# Altium schematic sheet PowerSheet1.SchDoc
size A3
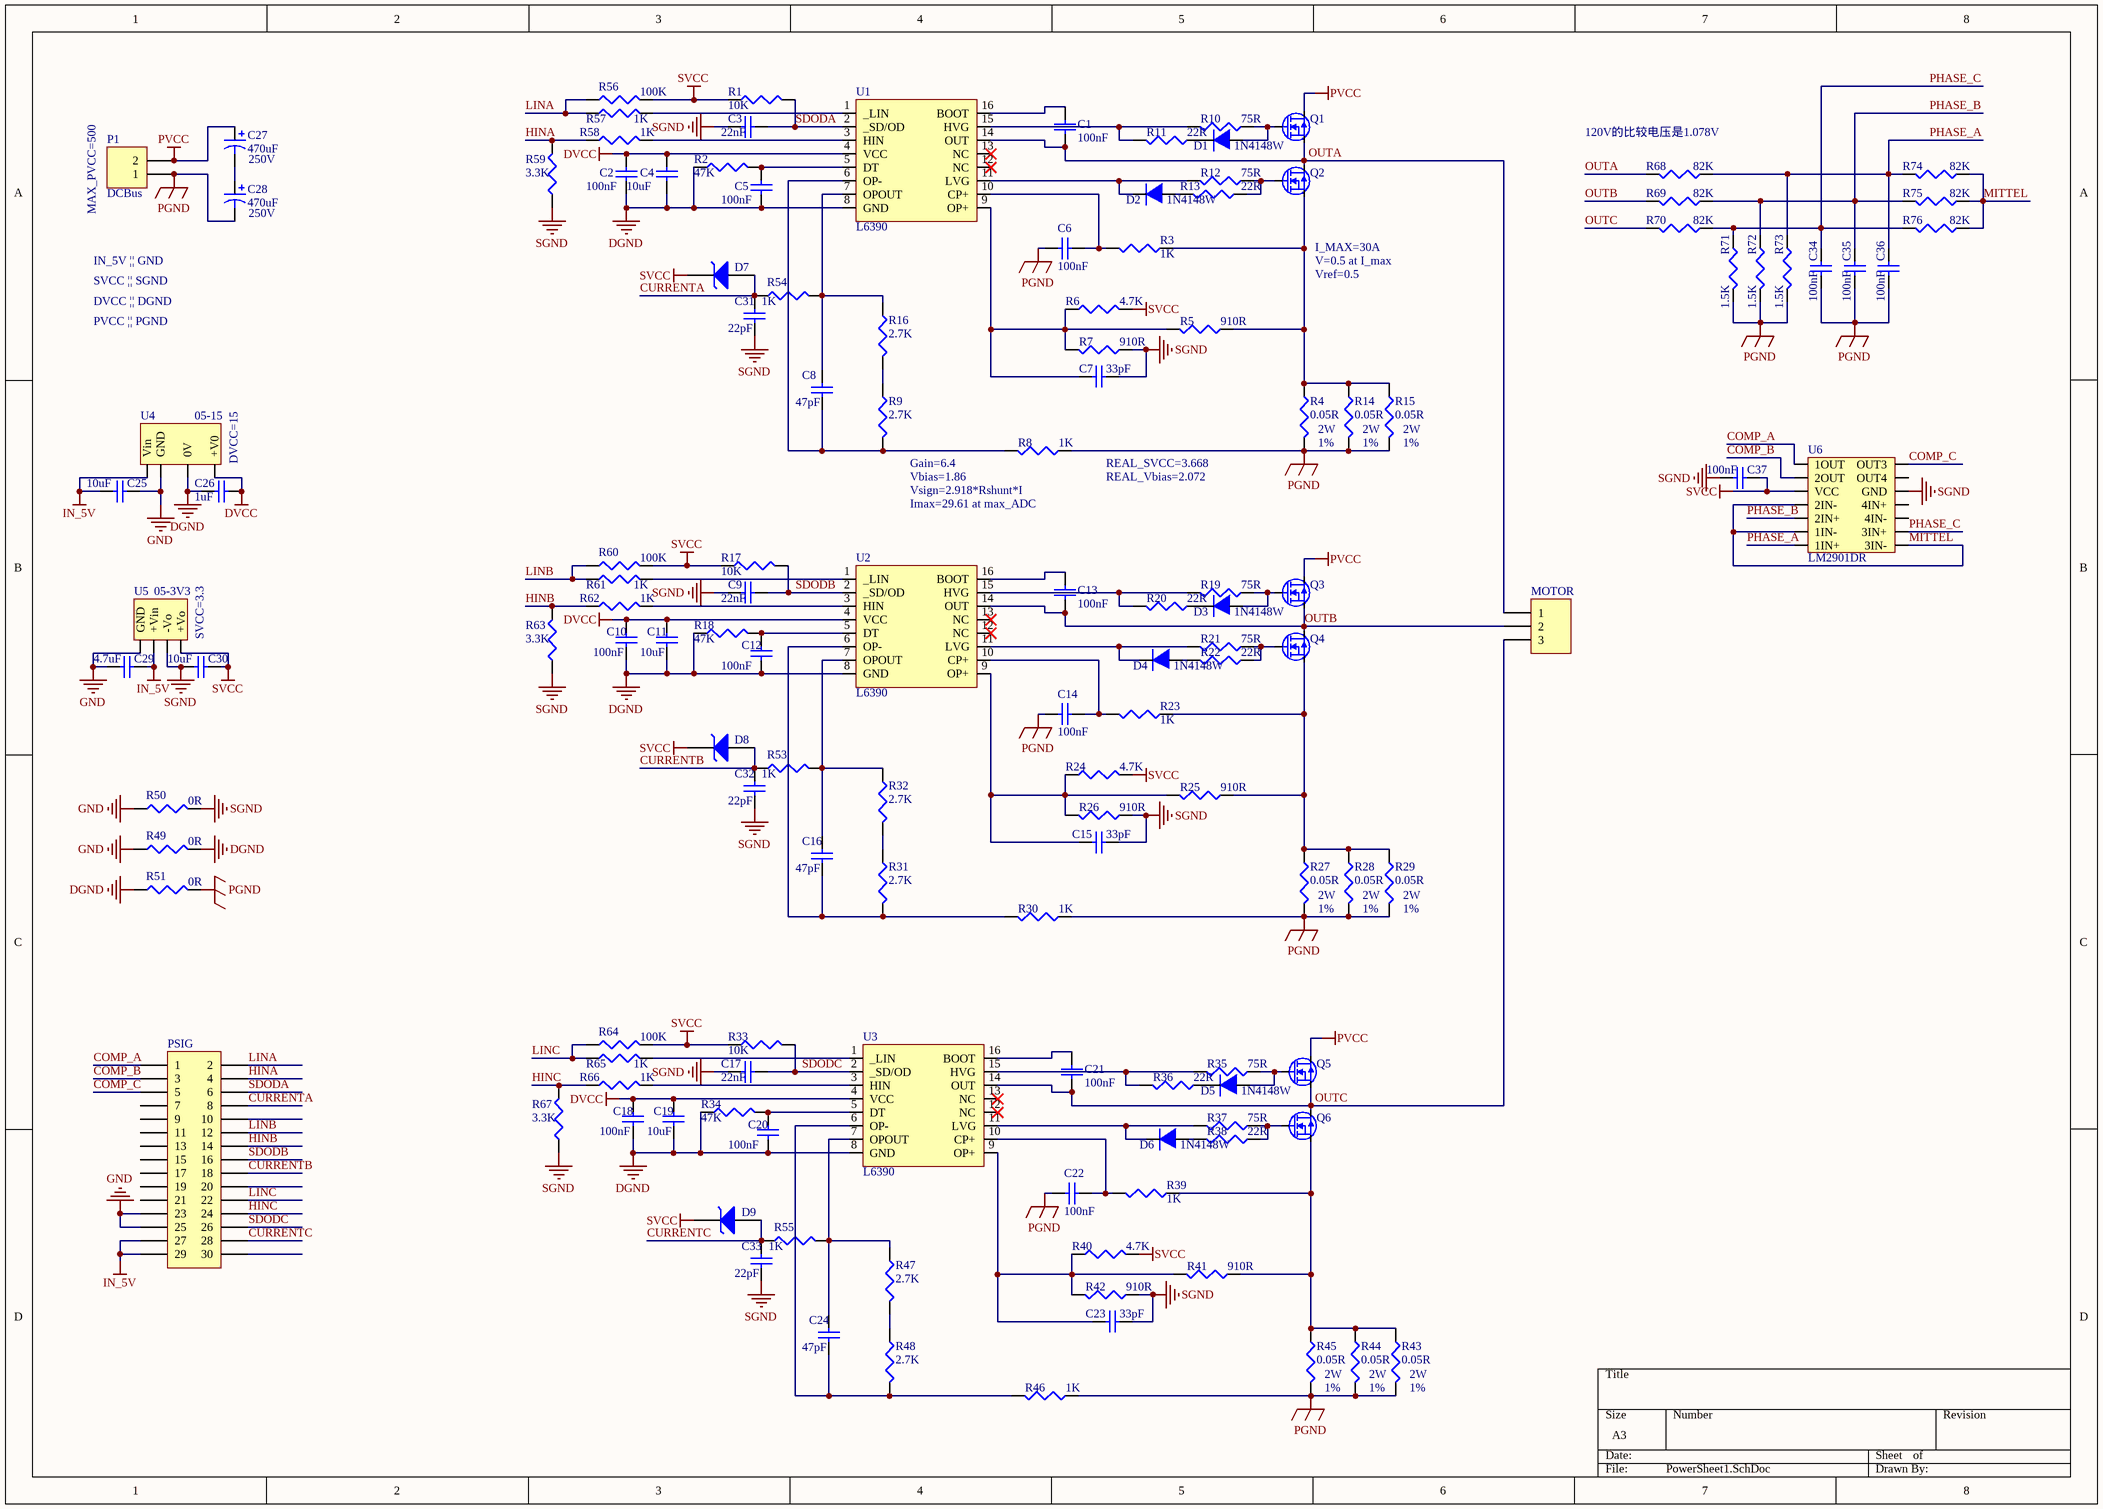
[diagram p0: PowerSheet1.SchDoc]

## Parts
C1  value 100nF  [LC-1210_C]  (hidden comment: Cap Semi)
C2  value 100nF  [LC-0805_C]  (hidden comment: Cap Semi)
C3  value 22nF  [LC-0805_C]  (hidden comment: Cap Semi)
C4  value 10uF  [LC-0805_C]  (hidden comment: Cap Semi)
C5  value 100nF  [LC-0805_C]  (hidden comment: Cap Semi)
C6  value 100nF  [LC-0805_C]  (hidden comment: Cap Semi)
C7  value 33pF  [LC-0805_C]  (hidden comment: Cap Semi)
C8  value 47pF  [LC-0805_C]  (hidden comment: Cap Semi)
C9  value 22nF  [LC-0805_C]  (hidden comment: Cap Semi)
C10  value 100nF  [LC-0805_C]  (hidden comment: Cap Semi)
C11  value 10uF  [LC-0805_C]  (hidden comment: Cap Semi)
C12  value 100nF  [LC-0805_C]  (hidden comment: Cap Semi)
C13  value 100nF  [LC-1210_C]  (hidden comment: Cap Semi)
C14  value 100nF  [LC-0805_C]  (hidden comment: Cap Semi)
C15  value 33pF  [LC-0805_C]  (hidden comment: Cap Semi)
C16  value 47pF  [LC-0805_C]  (hidden comment: Cap Semi)
C17  value 22nF  [LC-0805_C]  (hidden comment: Cap Semi)
C18  value 100nF  [LC-0805_C]  (hidden comment: Cap Semi)
C19  value 10uF  [LC-0805_C]  (hidden comment: Cap Semi)
C20  value 100nF  [LC-0805_C]  (hidden comment: Cap Semi)
C21  value 100nF  [LC-1210_C]  (hidden comment: Cap Semi)
C22  value 100nF  [LC-0805_C]  (hidden comment: Cap Semi)
C23  value 33pF  [LC-0805_C]  (hidden comment: Cap Semi)
C24  value 47pF  [LC-0805_C]  (hidden comment: Cap Semi)
C25  value 10uF  [LC-0805_C]  (hidden comment: Cap Semi)
C26  value 1uF  [LC-0805_C]  (hidden comment: Cap Semi)
C27  value 470uF  Voltage: 250V  [CAPACITORS]  (hidden comment: Cap Pol1)
C28  value 470uF  Voltage: 250V  [CAPACITORS]  (hidden comment: Cap Pol1)
C29  value 4.7uF  [LC-0805_C]  (hidden comment: Cap Semi)
C30  value 10uF  [LC-0805_C]  (hidden comment: Cap Semi)
C31  value 22pF  [LC-0805_C]  (hidden comment: Cap Semi)
C32  value 22pF  [LC-0805_C]  (hidden comment: Cap Semi)
C33  value 22pF  [LC-0805_C]  (hidden comment: Cap Semi)
C34  value 100nF  [LC-0805_C]  (hidden comment: Cap Semi)
C35  value 100nF  [LC-0805_C]  (hidden comment: Cap Semi)
C36  value 100nF  [LC-0805_C]  (hidden comment: Cap Semi)
C37  value 100nF  [LC-0805_C]  (hidden comment: Cap Semi)
D1  1N4148W  [SOD-123-D-IPC]
D2  1N4148W  [SOD-123-D-IPC]
D3  1N4148W  [SOD-123-D-IPC]
D4  1N4148W  [SOD-123-D-IPC]
D5  1N4148W  [SOD-123-D-IPC]
D6  1N4148W  [SOD-123-D-IPC]
D7  D Schottky  [MELF3416N]  (value not drawn)
D8  D Schottky  [MELF3416N]  (value not drawn)
D9  D Schottky  [MELF3416N]  (value not drawn)
MOTOR  Header 3  [MKDS5/3-9.5]  (value not drawn)
P1  DCBus  [MKDS5/2-9.5 - duplicate]
PSIG  Header 15X2  [HDR2X15]  (value not drawn)
Q1  MOSFET-N  [DPAK254P1525X450-3N-IPB60R080P7]  (value not drawn)
Q2  MOSFET-N  [DPAK254P1525X450-3N-IPB60R080P7]  (value not drawn)
Q3  MOSFET-N  [DPAK254P1525X450-3N-IPB60R080P7]  (value not drawn)
Q4  MOSFET-N  [DPAK254P1525X450-3N-IPB60R080P7]  (value not drawn)
Q5  MOSFET-N  [DPAK254P1525X450-3N-IPB60R080P7]  (value not drawn)
Q6  MOSFET-N  [DPAK254P1525X450-3N-IPB60R080P7]  (value not drawn)
R1  value 10K  [LC-0805_R]  (hidden comment: Res3)
R2  value 47K  [LC-0805_R]  (hidden comment: Res3)
R3  value 1K  [LC-0805_R]  (hidden comment: Res3)
R4  value 0.05R  Power: 2W  Precision: 1%  [12Z-2010]  (hidden comment: Res3)
R5  value 910R  [LC-0805_R]  (hidden comment: Res3)
R6  value 4.7K  [LC-0805_R]  (hidden comment: Res3)
R7  value 910R  [LC-0805_R]  (hidden comment: Res3)
R8  value 1K  [LC-0805_R]  (hidden comment: Res3)
R9  value 2.7K  [LC-0805_R]  (hidden comment: Res3)
R10  value 75R  [LC-0805_R]  (hidden comment: Res3)
R11  value 22R  [LC-0805_R]  (hidden comment: Res3)
R12  value 75R  [LC-0805_R]  (hidden comment: Res3)
R13  value 22R  [LC-0805_R]  (hidden comment: Res3)
R14  value 0.05R  Power: 2W  Precision: 1%  [12Z-2010]  (hidden comment: Res3)
R15  value 0.05R  Power: 2W  Precision: 1%  [12Z-2010]  (hidden comment: Res3)
R16  value 2.7K  [LC-0805_R]  (hidden comment: Res3)
R17  value 10K  [LC-0805_R]  (hidden comment: Res3)
R18  value 47K  [LC-0805_R]  (hidden comment: Res3)
R19  value 75R  [LC-0805_R]  (hidden comment: Res3)
R20  value 22R  [LC-0805_R]  (hidden comment: Res3)
R21  value 75R  [LC-0805_R]  (hidden comment: Res3)
R22  value 22R  [LC-0805_R]  (hidden comment: Res3)
R23  value 1K  [LC-0805_R]  (hidden comment: Res3)
R24  value 4.7K  [LC-0805_R]  (hidden comment: Res3)
R25  value 910R  [LC-0805_R]  (hidden comment: Res3)
R26  value 910R  [LC-0805_R]  (hidden comment: Res3)
R27  value 0.05R  Power: 2W  Precision: 1%  [12Z-2010]  (hidden comment: Res3)
R28  value 0.05R  Power: 2W  Precision: 1%  [12Z-2010]  (hidden comment: Res3)
R29  value 0.05R  Power: 2W  Precision: 1%  [12Z-2010]  (hidden comment: Res3)
R30  value 1K  [LC-0805_R]  (hidden comment: Res3)
R31  value 2.7K  [LC-0805_R]  (hidden comment: Res3)
R32  value 2.7K  [LC-0805_R]  (hidden comment: Res3)
R33  value 10K  [LC-0805_R]  (hidden comment: Res3)
R34  value 47K  [LC-0805_R]  (hidden comment: Res3)
R35  value 75R  [LC-0805_R]  (hidden comment: Res3)
R36  value 22R  [LC-0805_R]  (hidden comment: Res3)
R37  value 75R  [LC-0805_R]  (hidden comment: Res3)
R38  value 22R  [LC-0805_R]  (hidden comment: Res3)
R39  value 1K  [LC-0805_R]  (hidden comment: Res3)
R40  value 4.7K  [LC-0805_R]  (hidden comment: Res3)
R41  value 910R  [LC-0805_R]  (hidden comment: Res3)
R42  value 910R  [LC-0805_R]  (hidden comment: Res3)
R43  value 0.05R  Power: 2W  Precision: 1%  [12Z-2010]  (hidden comment: Res3)
R44  value 0.05R  Power: 2W  Precision: 1%  [12Z-2010]  (hidden comment: Res3)
R45  value 0.05R  Power: 2W  Precision: 1%  [12Z-2010]  (hidden comment: Res3)
R46  value 1K  [LC-0805_R]  (hidden comment: Res3)
R47  value 2.7K  [LC-0805_R]  (hidden comment: Res3)
R48  value 2.7K  [LC-0805_R]  (hidden comment: Res3)
R49  value 0R  [LC-0805_R]  (hidden comment: Res3)
R50  value 0R  [LC-0805_R]  (hidden comment: Res3)
R51  value 0R  [LC-0805_R]  (hidden comment: Res3)
R53  value 1K  [LC-0805_R]  (hidden comment: Res3)
R54  value 1K  [LC-0805_R]  (hidden comment: Res3)
R55  value 1K  [LC-0805_R]  (hidden comment: Res3)
R56  value 100K  [LC-0805_R]  (hidden comment: Res3)
R57  value 1K  [LC-0805_R]  (hidden comment: Res3)
R58  value 1K  [LC-0805_R]  (hidden comment: Res3)
R59  value 3.3K  [LC-0805_R]  (hidden comment: Res3)
R60  value 100K  [LC-0805_R]  (hidden comment: Res3)
R61  value 1K  [LC-0805_R]  (hidden comment: Res3)
R62  value 1K  [LC-0805_R]  (hidden comment: Res3)
R63  value 3.3K  [LC-0805_R]  (hidden comment: Res3)
R64  value 100K  [LC-0805_R]  (hidden comment: Res3)
R65  value 1K  [LC-0805_R]  (hidden comment: Res3)
R66  value 1K  [LC-0805_R]  (hidden comment: Res3)
R67  value 3.3K  [LC-0805_R]  (hidden comment: Res3)
R68  value 82K  [LC-0805_R]  (hidden comment: Res3)
R69  value 82K  [LC-0805_R]  (hidden comment: Res3)
R70  value 82K  [LC-0805_R]  (hidden comment: Res3)
R71  value 1.5K  [LC-0805_R]  (hidden comment: Res3)
R72  value 1.5K  [LC-0805_R]  (hidden comment: Res3)
R73  value 1.5K  [LC-0805_R]  (hidden comment: Res3)
R74  value 82K  [LC-0805_R]  (hidden comment: Res3)
R75  value 82K  [LC-0805_R]  (hidden comment: Res3)
R76  value 82K  [LC-0805_R]  (hidden comment: Res3)
U1  L6390  [SOIC127P660X175-16N]
U2  L6390  [SOIC127P660X175-16N]
U3  L6390  [SOIC127P660X175-16N]
U4  05-15  [ZY0515IB/FS-1W]
U5  05-3V3  [NN1-05S3V3A]
U6  LM2901DR  [LC-SOIC-14_150mil]

## Nets
DGND: C2.1 C4.1 C5.1 C10.1 C11.1 C12.1 C18.1 C19.1 C20.1 C26.2 R2.1 R18.1 R34.1 R49.2 R51.1 U1.8(GND) U2.8(GND) U3.8(GND) U4.4(0V)
DVCC: C2.2 C4.2 C10.2 C11.2 C18.2 C19.2 C26.1 U1.4(VCC) U2.4(VCC) U3.4(VCC) U4.6(+V0)
GND: C25.1 C29.2 PSIG.23 PSIG.25 R49.1 R50.1 U4.2(GND) U5.1(GND)
IN_5V: C25.2 C29.1 PSIG.27 PSIG.29 U4.1(Vin) U5.2(+Vin)
PGND: C6.2 C14.2 C22.2 C28.2 C34.2 C35.2 C36.2 P1.1 R4.2 R8.1 R14.2 R15.2 R27.2 R28.2 R29.2 R30.1 R43.2 R44.2 R45.2 R46.1 R51.2 R71.2 R72.2 R73.2
PVCC: C27.1 P1.2 Q1.D Q3.D Q5.D
SGND: C3.2 C7.2 C9.2 C15.2 C17.2 C23.2 C30.2 C31.2 C32.2 C33.2 C37.1 R7.1 R26.1 R42.1 R50.2 R59.1 R63.1 R67.1 U5.3(-Vo) U6.12(GND)
SVCC: C30.1 C37.2 D7.2(K) D8.2(K) D9.2(K) R1.1 R6.2 R17.1 R24.2 R33.1 R40.2 R56.2 R60.2 R64.2 U5.4(+Vo) U6.3(VCC)
COMP_A: PSIG.1 U6.1(1OUT)
COMP_B: PSIG.3 U6.2(2OUT)
COMP_C: PSIG.5 U6.14(OUT3)
CURRENTA: C31.1 D7.1(A) PSIG.8 R54.1
CURRENTB: C32.1 D8.1(A) PSIG.18 R53.1
CURRENTC: C33.1 D9.1(A) PSIG.28 R55.1
HINA: PSIG.4 R58.1 R59.2
HINB: PSIG.14 R62.1 R63.2
HINC: PSIG.24 R66.1 R67.2
LINA: PSIG.2 R56.1 R57.1
LINB: PSIG.12 R60.1 R61.1
LINC: PSIG.22 R64.1 R65.1
MITTEL: R74.1 R75.1 R76.1 U6.4(2IN-) U6.6(1IN-) U6.8(3IN-)
OUTA: C1.1 MOTOR.1 Q1.S Q2.D R68.2 U1.14(OUT)
OUTB: C13.1 MOTOR.2 Q3.S Q4.D R69.2 U2.14(OUT)
OUTC: C21.1 MOTOR.3 Q5.S Q6.D R70.2 U3.14(OUT)
PHASE_A: C36.1 R68.1 R73.1 R74.2 U6.7(1IN+)
PHASE_B: C35.1 R69.1 R72.1 R75.2 U6.5(2IN+)
PHASE_C: C34.1 R70.1 R71.1 R76.2 U6.9(3IN+)
SDODA: C3.1 PSIG.6 R1.2 U1.2(_SD/OD)
SDODB: C9.1 PSIG.16 R17.2 U2.2(_SD/OD)
SDODC: C17.1 PSIG.26 R33.2 U3.2(_SD/OD)
NetC1_2: C1.2 U1.16(BOOT)
NetC5_2: C5.2 R2.2 U1.5(DT)
NetC6_1: C6.1 R3.2 U1.10(CP+)
NetC7_1: C7.1 R5.2 R6.1 R7.2 U1.9(OP+)
NetC8_1: C8.1 R16.1 R54.2 U1.7(OPOUT)
NetC8_2: C8.2 R8.2 R9.2 U1.6(OP-)
NetC12_2: C12.2 R18.2 U2.5(DT)
NetC13_2: C13.2 U2.16(BOOT)
NetC14_1: C14.1 R23.2 U2.10(CP+)
NetC15_1: C15.1 R24.1 R25.2 R26.2 U2.9(OP+)
NetC16_1: C16.1 R32.1 R53.2 U2.7(OPOUT)
NetC16_2: C16.2 R30.2 R31.2 U2.6(OP-)
NetC20_2: C20.2 R34.2 U3.5(DT)
NetC21_2: C21.2 U3.16(BOOT)
NetC22_1: C22.1 R39.2 U3.10(CP+)
NetC23_1: C23.1 R40.1 R41.2 R42.2 U3.9(OP+)
NetC24_1: C24.1 R47.1 R55.2 U3.7(OPOUT)
NetC24_2: C24.2 R46.2 R48.2 U3.6(OP-)
NetC27_2: C27.2 C28.1
NetD1_1: D1.1 R11.1
NetD1_2: D1.2 Q1.G R10.1
NetD2_1: D2.1 R12.2 U1.11(LVG)
NetD2_2: D2.2 R13.2
NetD3_1: D3.1 R20.1
NetD3_2: D3.2 Q3.G R19.1
NetD4_1: D4.1 R21.2 U2.11(LVG)
NetD4_2: D4.2 R22.2
NetD5_1: D5.1 R36.1
NetD5_2: D5.2 Q5.G R35.1
NetD6_1: D6.1 R37.2 U3.11(LVG)
NetD6_2: D6.2 R38.2
NetQ2_G: Q2.G R12.1 R13.1
NetQ2_S: Q2.S R3.1 R4.1 R5.1 R14.1 R15.1
NetQ4_G: Q4.G R21.1 R22.1
NetQ4_S: Q4.S R23.1 R25.1 R27.1 R28.1 R29.1
NetQ6_G: Q6.G R37.1 R38.1
NetQ6_S: Q6.S R39.1 R41.1 R43.1 R44.1 R45.1
NetR9_1: R9.1 R16.2
NetR10_2: R10.2 R11.2 U1.15(HVG)
NetR19_2: R19.2 R20.2 U2.15(HVG)
NetR31_1: R31.1 R32.2
NetR35_2: R35.2 R36.2 U3.15(HVG)
NetR47_2: R47.2 R48.1
NetR57_2: R57.2 U1.1(_LIN)
NetR58_2: R58.2 U1.3(HIN)
NetR61_2: R61.2 U2.1(_LIN)
NetR62_2: R62.2 U2.3(HIN)
NetR65_2: R65.2 U3.1(_LIN)
NetR66_2: R66.2 U3.3(HIN)

Not connected (* = marked no-connect by the designer): PSIG 7 9 10 11 13 15 17 19 20 21 30; U1 12(NC)* 13(NC)*; U2 12(NC)* 13(NC)*; U3 12(NC)* 13(NC)*; U6 10(4IN-) 11(4IN+) 13(OUT4)

## Notes on the sheet
- (near R68) 120V的比较电压是1.078V
- (near P1) MAX_PVCC=500
- IN_5V || GND
- SVCC || SGND
- DVCC || DGND
- (near Q2) I_MAX=30A
- V=0.5 at I_max
- Vref=0.5
- PVCC || PGND
- (near U4) DVCC=15
- (near R9) Gain=6.4
- Vbias=1.86
- Vsign=2.918*Rshunt*I
- Imax=29.61 at max_ADC
- (near R8) REAL_SVCC=3.668
- (near R8) REAL_Vbias=2.072
- (near U5) SVCC=3.3

## Library data of the parts
C1-C26 C29-C37 = Cap Semi: Capacitor (Semiconductor SIM Model); Published: 8-Jun-2000; LatestRevisionDate: 29-May-2009; LatestRevisionNote: IPC-7351 Footprint Added.; PackageReference: C1206; Publisher: Altium Limited; PackageDescription: Chip Capacitor
C27 C28 = Cap Pol1: Polarized Capacitor (Radial); Published: 8-Jun-2000; LatestRevisionDate: 17-Jul-2002; LatestRevisionNote: Re-released for DXP Platform.; PackageReference: RB7.6-15; Publisher: Altium Limited; PackageDescription: Polarized Capacitor (Radial); 2 Leads
D1-D6 = 1N4148: 1N4148WS
D7-D9 = D Schottky: TMMBAT48FILM
MOTOR = Header 3: Header, 3-Pin; LatestRevisionDate: 17-Jul-2002; LatestRevisionNote: Re-released for DXP Platform.; Publisher: Altium Limited
P1 = Header 2: Header, 2-Pin; LatestRevisionDate: 17-Jul-2002; LatestRevisionNote: Re-released for DXP Platform.; Publisher: Altium Limited
PSIG = Header 15X2: Header, 15-Pin, Dual row; LatestRevisionDate: 17-Jul-2002; LatestRevisionNote: Re-released for DXP Platform.; Publisher: Altium Limited
Q1-Q6 = MOSFET-N: IPB60R080P7
R1-R51 R53-R76 = Res3: Resistor; Published: 8-Jun-2000; LatestRevisionDate: 29-May-2009; LatestRevisionNote: IPC-7351 Footprint Added.; PackageReference: J1-0603; Publisher: Altium Limited; PackageDescription: Chip Resistor
U1-U3 = L6390: ST High voltage high/low-side driver
U4 = ZY0515IB/FS-1W
U5 = NN1-05S3V3A: NN1-05S3V3A DC/DC
U6 = LM2901DR: QUAD DIFFERENTIAL COMPARATORS